# Altium schematic sheet Temp_NTC.SchDoc: Temp NTC
size A4; Revision: 1.0; SheetNumber: 7; SheetTotal: 11; Class: B
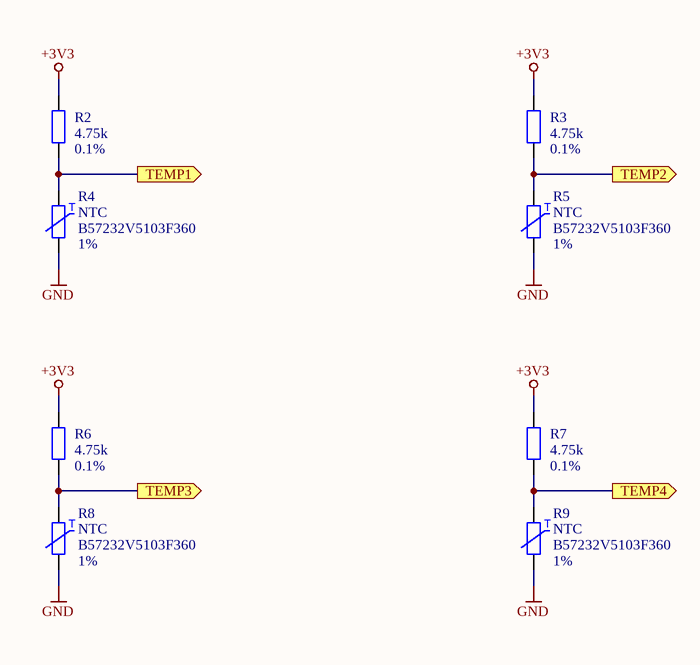
[diagram p0: Temp_NTC.SchDoc]

## Parts
R2  value 4.75k  Tolerance: 0.1%  [R_0402]  (hidden comment: R)
R3  value 4.75k  Tolerance: 0.1%  [R_0402]  (hidden comment: R)
R4  value B57232V5103F360  Tolerance: 1%  [R_0402]  (hidden comment: R_B572xxV5)
R5  value B57232V5103F360  Tolerance: 1%  [R_0402]  (hidden comment: R_B572xxV5)
R6  value 4.75k  Tolerance: 0.1%  [R_0402]  (hidden comment: R)
R7  value 4.75k  Tolerance: 0.1%  [R_0402]  (hidden comment: R)
R8  value B57232V5103F360  Tolerance: 1%  [R_0402]  (hidden comment: R_B572xxV5)
R9  value B57232V5103F360  Tolerance: 1%  [R_0402]  (hidden comment: R_B572xxV5)

## Ports
TEMP1 (out), TEMP2 (out), TEMP3 (out), TEMP4 (out)

## Nets
+3V3: R2.1 R3.1 R6.1 R7.1
GND: R4.2 R5.2 R8.2 R9.2
TEMP1: R2.2 R4.1 ; port TEMP1
TEMP2: R3.2 R5.1 ; port TEMP2
TEMP3: R6.2 R8.1 ; port TEMP3
TEMP4: R7.2 R9.1 ; port TEMP4

## Notes on the sheet
- Title:
- Date:
- Revision:
- Class:
- Sheet
- of
- (in symbol B57232V5103F360) T

## Library data of the parts
R2 R3 R6 R7 = R_4.75k_50V_0402: Manufacturer: Vishay; Manufacturer Part Number: MCS0402MD4751BE100; Voltage: 50V; RMS Power: 0.1W; TCR: 25ppm; Tmax: 155; Tmin: -55; Grade: 2; Part Number: R_4.75k_50V_0402; HelpURL: https://www.vishay.com/docs/28785/mcat_pre.pdf; Supplier 2: Mouser; Supplier Part Number 2: 594-MCS0402MD4751BE1; Supplier 1: Digi-Key; Supplier Part Number 1: MCS0402-4.75K-MBCT-ND
R4 R5 R8 R9 = B57232V5103F360: NTC; Manufacturer: TDK; Resistance: 10k; Tmax: 150; Tmin: -40; Grade: 2; Desc: NTC; Part Number: B57232V5103F360; HelpURL: https://product.tdk.com/info/en/documents/data_sheet/50/db/ntc/NTC_SMD_Automotive_series_0402.pdf; Manufacturer Part Number: B57232V5103F360; Supplier 1: Mouser; Supplier Part Number 1: 871-B57232V5103F360; Status: Active